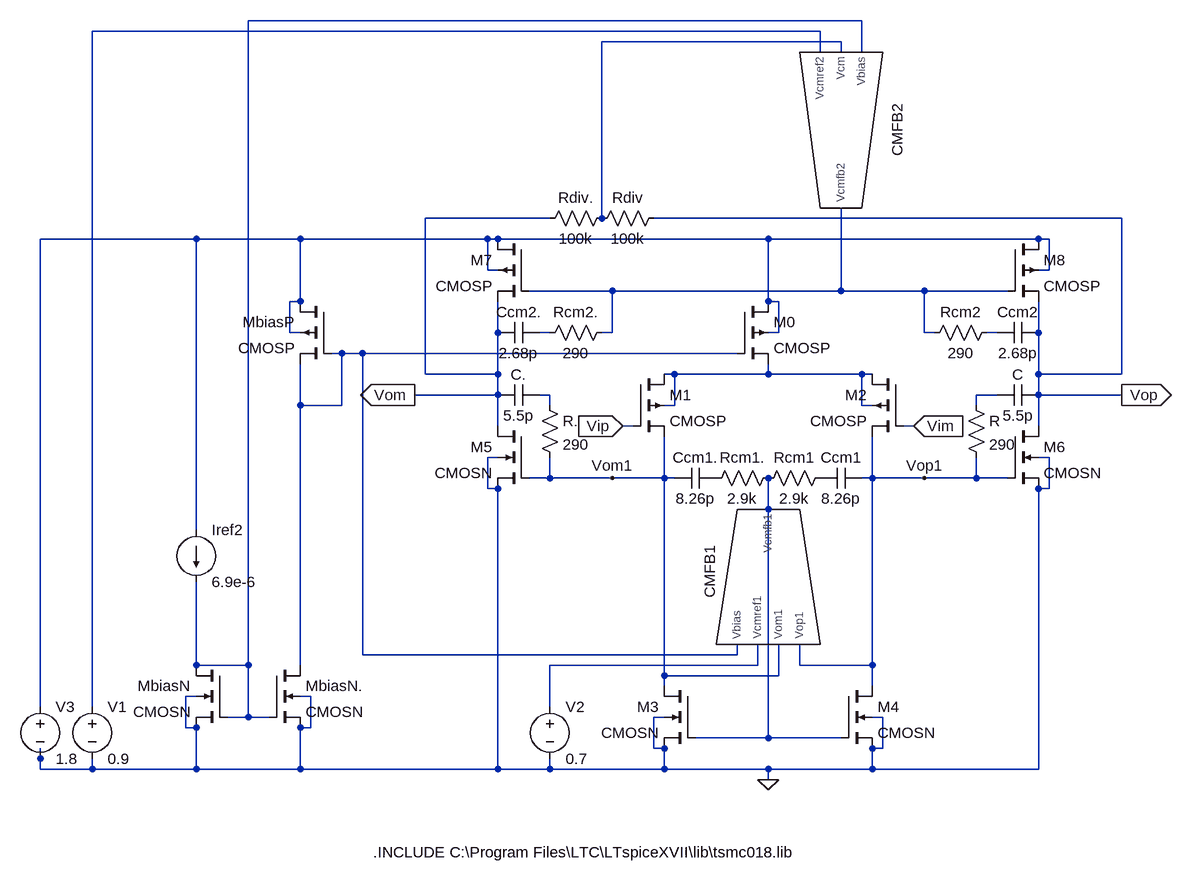
[diagram p0: schematic TwoStageFullyDiffOpamp.asc]
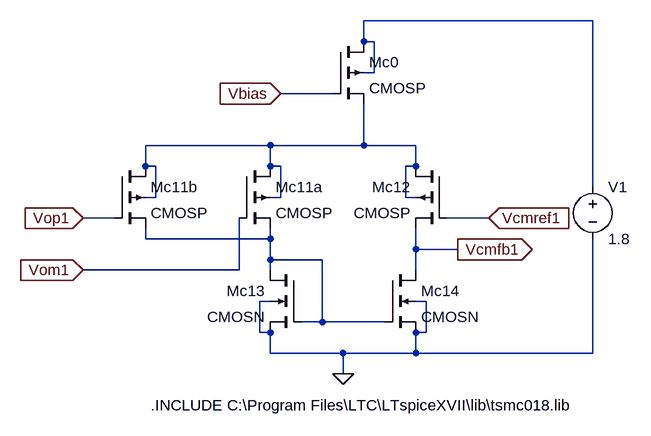
[diagram p1: sub-circuit stage1commonmodefeedback.asc]
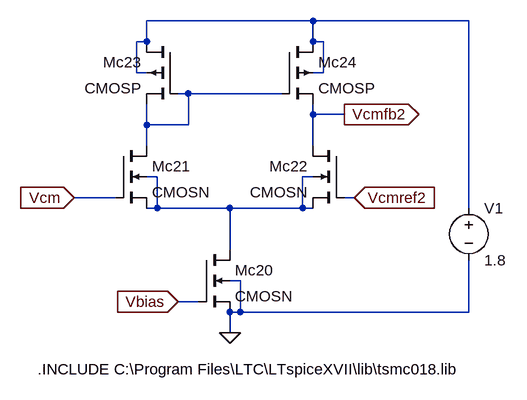
[diagram p2: sub-circuit stage2commonmodefeedback.asc]
TwoStageFullyDiffOpamp.asc, the LTspice schematic file:
Version 4
SHEET 1 1544 680
WIRE 512 -752 -432 -752
WIRE 448 -736 -672 -736
WIRE 480 -720 112 -720
WIRE 448 -704 448 -736
WIRE 480 -704 480 -720
WIRE 512 -704 512 -752
WIRE 32 -448 -160 -448
WIRE 112 -448 112 -720
WIRE 912 -448 192 -448
WIRE -512 -416 -752 -416
WIRE -352 -416 -512 -416
WIRE -64 -416 -352 -416
WIRE -48 -416 -64 -416
WIRE 368 -416 -48 -416
WIRE 784 -416 368 -416
WIRE 800 -416 784 -416
WIRE -64 -368 -64 -416
WIRE -48 -368 -64 -368
WIRE 800 -368 800 -416
WIRE 800 -368 784 -368
WIRE 128 -336 0 -336
WIRE 480 -336 480 -464
WIRE 480 -336 128 -336
WIRE 608 -336 480 -336
WIRE 736 -336 608 -336
WIRE -352 -320 -352 -416
WIRE -352 -320 -368 -320
WIRE 368 -320 368 -416
WIRE 384 -320 368 -320
WIRE -368 -272 -368 -320
WIRE -352 -272 -368 -272
WIRE -48 -272 -48 -320
WIRE 32 -272 16 -272
WIRE 128 -272 128 -336
WIRE 128 -272 112 -272
WIRE 384 -272 384 -320
WIRE 384 -272 368 -272
WIRE 608 -272 608 -336
WIRE 624 -272 608 -272
WIRE 720 -272 704 -272
WIRE 784 -272 784 -320
WIRE -288 -240 -304 -240
WIRE -256 -240 -288 -240
WIRE 320 -240 -256 -240
WIRE -160 -208 -160 -448
WIRE -48 -208 -48 -272
WIRE -48 -208 -160 -208
WIRE 224 -208 208 -208
WIRE 368 -208 368 -224
WIRE 368 -208 224 -208
WIRE 512 -208 368 -208
WIRE 528 -208 512 -208
WIRE 784 -208 784 -272
WIRE 912 -208 912 -448
WIRE 912 -208 784 -208
WIRE -48 -176 -48 -208
WIRE -48 -176 -176 -176
WIRE 32 -176 16 -176
WIRE 720 -176 688 -176
WIRE 784 -176 784 -208
WIRE 912 -176 784 -176
WIRE -352 -160 -352 -224
WIRE -288 -160 -288 -240
WIRE -288 -160 -352 -160
WIRE 32 -160 32 -176
WIRE 224 -160 224 -208
WIRE 224 -160 208 -160
WIRE 512 -160 512 -208
WIRE 528 -160 512 -160
WIRE 688 -160 688 -176
WIRE -48 -128 -48 -176
WIRE 160 -128 144 -128
WIRE 592 -128 576 -128
WIRE 784 -128 784 -176
WIRE -48 -80 -64 -80
WIRE 800 -80 784 -80
WIRE 32 -48 32 -80
WIRE 32 -48 0 -48
WIRE 128 -48 32 -48
WIRE 208 -48 208 -112
WIRE 208 -48 128 -48
WIRE 224 -48 208 -48
WIRE 528 -48 528 -112
WIRE 528 -48 512 -48
WIRE 608 -48 528 -48
WIRE 688 -48 688 -80
WIRE 688 -48 608 -48
WIRE 736 -48 688 -48
WIRE -64 -32 -64 -80
WIRE -48 -32 -64 -32
WIRE 800 -32 800 -80
WIRE 800 -32 784 -32
WIRE 368 0 368 -48
WIRE -512 32 -512 -416
WIRE -256 224 -256 -240
WIRE 320 224 320 208
WIRE 320 224 -256 224
WIRE -512 240 -512 112
WIRE -432 240 -432 -752
WIRE -432 240 -512 240
WIRE -352 240 -352 -160
WIRE 352 240 352 208
WIRE 352 240 32 240
WIRE 416 240 416 208
WIRE 528 240 528 -48
WIRE 528 240 416 240
WIRE 208 256 208 -48
WIRE 384 256 384 208
WIRE 384 256 208 256
WIRE 208 272 208 256
WIRE 528 272 528 240
WIRE -512 288 -528 288
WIRE -336 288 -352 288
WIRE -752 304 -752 -416
WIRE -672 304 -672 -736
WIRE 32 304 32 240
WIRE -432 320 -432 240
WIRE -432 320 -464 320
WIRE -400 320 -432 320
WIRE 208 320 192 320
WIRE 544 320 528 320
WIRE -528 336 -528 288
WIRE -512 336 -528 336
WIRE -336 336 -336 288
WIRE -336 336 -352 336
WIRE 368 352 368 0
WIRE 368 352 256 352
WIRE 480 352 368 352
WIRE 192 368 192 320
WIRE 208 368 192 368
WIRE 544 368 544 320
WIRE 544 368 528 368
WIRE -752 384 -752 368
WIRE -752 400 -752 384
WIRE -672 400 -672 384
WIRE -672 400 -752 400
WIRE -512 400 -512 336
WIRE -512 400 -672 400
WIRE -352 400 -352 336
WIRE -352 400 -512 400
WIRE -48 400 -48 -32
WIRE -48 400 -352 400
WIRE 32 400 32 384
WIRE 32 400 -48 400
WIRE 208 400 208 368
WIRE 208 400 32 400
WIRE 368 400 208 400
WIRE 528 400 528 368
WIRE 528 400 368 400
WIRE 784 400 784 -32
WIRE 784 400 528 400
WIRE 368 416 368 400
FLAG 608 -48 Vop1
FLAG 128 -48 Vom1
FLAG 592 -128 Vim
IOPIN 592 -128 In
FLAG 144 -128 Vip
IOPIN 144 -128 In
FLAG 368 416 0
FLAG 912 -176 Vop
IOPIN 912 -176 Out
FLAG -176 -176 Vom
IOPIN -176 -176 Out
SYMBOL cap 224 -32 R270
WINDOW 0 32 32 VTop 2
WINDOW 3 0 32 VBottom 2
SYMATTR InstName Ccm1.
SYMATTR Value 8.26p
SYMBOL cap 448 -32 R270
WINDOW 0 32 32 VTop 2
WINDOW 3 0 32 VBottom 2
SYMATTR InstName Ccm1
SYMATTR Value 8.26p
SYMBOL Stage1CommonModeFeedback 368 96 R270
SYMATTR InstName CMFB1
SYMBOL cap 16 -192 R90
WINDOW 0 0 32 VBottom 2
WINDOW 3 32 32 VTop 2
SYMATTR InstName C.
SYMATTR Value 5.5p
SYMBOL cap 784 -288 R90
WINDOW 0 0 32 VBottom 2
WINDOW 3 32 32 VTop 2
SYMATTR InstName Ccm2
SYMATTR Value 2.68p
SYMBOL cap 16 -288 R90
WINDOW 0 0 32 VBottom 2
WINDOW 3 32 32 VTop 2
SYMATTR InstName Ccm2.
SYMATTR Value 2.68p
SYMBOL nmos4 0 -128 M0
SYMATTR InstName M5
SYMATTR Value CMOSN
SYMATTR Value2 l=0.18µ w=10.35µ ad=3.726p as=3.726p pd=21.42µ ps=21.42µ
SYMBOL pmos4 160 -208 R0
SYMATTR InstName M1
SYMATTR Value CMOSP
SYMATTR Value2 l=0.18µ w=4.14µ ad=1.4904p as=1.4904p pd=9µ ps=9µ
SYMBOL pmos4 0 -416 M0
SYMATTR InstName M7
SYMATTR Value CMOSP
SYMATTR Value2 l=0.18µ w=41.4µ ad=14.904p as=14.904p pd=83.52µ ps=83.52µ
SYMBOL cap 784 -192 R90
WINDOW 0 0 32 VBottom 2
WINDOW 3 32 32 VTop 2
SYMATTR InstName C
SYMATTR Value 5.5p
SYMBOL voltage 32 288 R0
WINDOW 123 0 0 Left 2
WINDOW 39 0 0 Left 2
SYMATTR InstName V2
SYMATTR Value 0.7
SYMBOL res 16 -176 R0
SYMATTR InstName R.
SYMATTR Value 290
SYMBOL res 672 -176 R0
SYMATTR InstName R
SYMATTR Value 290
SYMBOL res 384 -64 R90
WINDOW 0 0 56 VBottom 2
WINDOW 3 32 56 VTop 2
SYMATTR InstName Rcm1.
SYMATTR Value 2.9k
SYMBOL res 464 -64 R90
WINDOW 0 0 56 VBottom 2
WINDOW 3 32 56 VTop 2
SYMATTR InstName Rcm1
SYMATTR Value 2.9k
SYMBOL res 128 -288 R90
WINDOW 0 0 56 VBottom 2
WINDOW 3 32 56 VTop 2
SYMATTR InstName Rcm2.
SYMATTR Value 290
SYMBOL res 720 -288 R90
WINDOW 0 0 56 VBottom 2
WINDOW 3 32 56 VTop 2
SYMATTR InstName Rcm2
SYMATTR Value 290
SYMBOL res 128 -464 R90
WINDOW 0 0 56 VBottom 2
WINDOW 3 32 56 VTop 2
SYMATTR InstName Rdiv.
SYMATTR Value 100k
SYMBOL res 208 -464 R90
WINDOW 0 0 56 VBottom 2
WINDOW 3 32 56 VTop 2
SYMATTR InstName Rdiv
SYMATTR Value 100k
SYMBOL Stage2CommonModeFeedback 480 -592 R90
SYMATTR InstName CMFB2
SYMBOL voltage -672 288 R0
WINDOW 123 0 0 Left 2
WINDOW 39 0 0 Left 2
SYMATTR InstName V1
SYMATTR Value 0.9
SYMBOL voltage -752 288 R0
WINDOW 123 0 0 Left 2
WINDOW 39 0 0 Left 2
SYMATTR InstName V3
SYMATTR Value 1.8
SYMBOL current -512 32 R0
WINDOW 123 0 0 Left 2
WINDOW 39 0 0 Left 2
SYMATTR InstName Iref2
SYMATTR Value 6.9e-6
SYMBOL nmos4 -464 240 M0
SYMATTR InstName MbiasN
SYMATTR Value CMOSN
SYMATTR Value2 l=0.2086956522µ w=0.24µ ad=0.0864p as=0.0864p pd=1.2µ ps=1.2µ
SYMBOL pmos4 -304 -320 M0
SYMATTR InstName MbiasP
SYMATTR Value CMOSP
SYMATTR Value2 l=0.18µ w=0.828µ ad=0.29808p as=0.29808p pd=2.376µ ps=2.376µ
SYMBOL pmos4 576 -208 M0
SYMATTR InstName M2
SYMATTR Value CMOSP
SYMATTR Value2 l=0.18µ w=4.14µ ad=1.4904p as=1.4904p pd=9µ ps=9µ
SYMBOL nmos4 480 272 R0
SYMATTR InstName M4
SYMATTR Value CMOSN
SYMATTR Value2 l=0.18µ w=1.035µ ad=0.3726p as=0.3726p pd=2.79µ ps=2.79µ
SYMBOL pmos4 320 -320 R0
SYMATTR InstName M0
SYMATTR Value CMOSP
SYMATTR Value2 l=0.18µ w=0.828µ ad=0.29808p as=0.29808p pd=2.376µ ps=2.376µ m=10
SYMBOL nmos4 -400 240 R0
SYMATTR InstName MbiasN.
SYMATTR Value CMOSN
SYMATTR Value2 l=0.2086956522µ w=0.24µ ad=0.0864p as=0.0864p pd=1.2µ ps=1.2µ
SYMBOL nmos4 256 272 M0
SYMATTR InstName M3
SYMATTR Value CMOSN
SYMATTR Value2 l=0.18µ w=1.035µ ad=0.3726p as=0.3726p pd=2.79µ ps=2.79µ
SYMBOL nmos4 736 -128 R0
SYMATTR InstName M6
SYMATTR Value CMOSN
SYMATTR Value2 l=0.18µ w=10.35µ ad=3.726p as=3.726p pd=21.42µ ps=21.42µ
SYMBOL pmos4 736 -416 R0
SYMATTR InstName M8
SYMATTR Value CMOSP
SYMATTR Value2 l=0.18µ w=41.4µ ad=14.904p as=14.904p pd=83.52µ ps=83.52µ
TEXT -240 528 Left 2 !.INCLUDE C:\\Program Files\\LTC\\LTspiceXVII\\lib\\tsmc018.lib

stage1commonmodefeedback.asc, the sub-circuit schematic file:
Version 4
SHEET 1 1048 680
WIRE 752 -48 400 -48
WIRE 400 -16 400 -48
WIRE 416 -16 400 -16
WIRE 416 32 416 -16
WIRE 416 32 400 32
WIRE 352 64 272 64
WIRE 256 144 64 144
WIRE 400 144 400 80
WIRE 400 144 256 144
WIRE 480 144 400 144
WIRE 64 176 64 144
WIRE 80 176 64 176
WIRE 256 176 256 144
WIRE 272 176 256 176
WIRE 480 176 480 144
WIRE 480 176 464 176
WIRE 752 208 752 -48
WIRE 80 224 80 176
WIRE 80 224 64 224
WIRE 272 224 272 176
WIRE 272 224 256 224
WIRE 464 224 464 176
WIRE 480 224 464 224
WIRE 16 256 -32 256
WIRE 592 256 528 256
WIRE 64 288 64 272
WIRE 256 288 256 272
WIRE 256 288 64 288
WIRE 480 304 480 272
WIRE 544 304 480 304
WIRE 256 320 256 288
WIRE 336 320 256 320
WIRE 208 336 208 256
WIRE 208 336 -32 336
WIRE 256 336 256 320
WIRE 480 336 480 304
WIRE 256 384 240 384
WIRE 496 384 480 384
WIRE 336 416 336 320
WIRE 336 416 304 416
WIRE 432 416 336 416
WIRE 240 432 240 384
WIRE 256 432 240 432
WIRE 496 432 496 384
WIRE 496 432 480 432
WIRE 256 464 256 432
WIRE 368 464 256 464
WIRE 480 464 480 432
WIRE 480 464 368 464
WIRE 752 464 752 288
WIRE 752 464 480 464
WIRE 368 496 368 464
FLAG 368 496 0
FLAG -32 256 Vop1
IOPIN -32 256 In
FLAG -32 336 Vom1
IOPIN -32 336 In
FLAG 592 256 Vcmref1
IOPIN 592 256 In
FLAG 272 64 Vbias
IOPIN 272 64 In
FLAG 544 304 Vcmfb1
IOPIN 544 304 Out
SYMBOL voltage 752 192 R0
WINDOW 123 0 0 Left 2
WINDOW 39 0 0 Left 2
SYMATTR InstName V1
SYMATTR Value 1.8
SYMBOL pmos4 528 176 M0
SYMATTR InstName Mc12
SYMATTR Value CMOSP
SYMATTR Value2 l=0.18µ w=0.414µ ad=0.14904p as=0.14904p pd=1.548µ ps=1.548µ
SYMBOL nmos4 432 336 R0
SYMATTR InstName Mc14
SYMATTR Value CMOSN
SYMATTR Value2 l=0.4173913043µ w=0.24µ ad=0.0864p as=0.0864p pd=1.2µ ps=1.2µ
SYMBOL pmos4 208 176 R0
SYMATTR InstName Mc11a
SYMATTR Value CMOSP
SYMATTR Value2 l=0.2086956522µ w=0.24µ ad=0.0864p as=0.0864p pd=1.2µ ps=1.2µ
SYMBOL pmos4 352 -16 R0
SYMATTR InstName Mc0
SYMATTR Value CMOSP
SYMATTR Value2 l=0.18µ w=0.828µ ad=0.29808p as=0.29808p pd=2.376µ ps=2.376µ
SYMBOL pmos4 16 176 R0
SYMATTR InstName Mc11b
SYMATTR Value CMOSP
SYMATTR Value2 l=0.2086956522µ w=0.24µ ad=0.0864p as=0.0864p pd=1.2µ ps=1.2µ
SYMBOL nmos4 304 336 M0
SYMATTR InstName Mc13
SYMATTR Value CMOSN
SYMATTR Value2 l=0.4173913043µ w=0.24µ ad=0.0864p as=0.0864p pd=1.2µ ps=1.2µ
TEXT 72 544 Left 2 !.INCLUDE C:\\Program Files\\LTC\\LTspiceXVII\\lib\\tsmc018.lib

stage2commonmodefeedback.asc, the sub-circuit schematic file:
Version 4
SHEET 1 1116 680
WIRE 816 -144 560 -144
WIRE 1056 -144 816 -144
WIRE 560 -112 560 -144
WIRE 560 -112 544 -112
WIRE 816 -112 816 -144
WIRE 832 -112 816 -112
WIRE 544 -64 544 -112
WIRE 560 -64 544 -64
WIRE 832 -64 832 -112
WIRE 832 -64 816 -64
WIRE 624 -32 608 -32
WIRE 768 -32 624 -32
WIRE 816 0 816 -16
WIRE 864 0 816 0
WIRE 560 16 560 -16
WIRE 624 16 624 -32
WIRE 624 16 560 16
WIRE 560 48 560 16
WIRE 816 48 816 0
WIRE 576 96 560 96
WIRE 816 96 800 96
WIRE 512 128 448 128
WIRE 880 128 864 128
WIRE 576 144 576 96
WIRE 576 144 560 144
WIRE 688 144 576 144
WIRE 800 144 800 96
WIRE 800 144 688 144
WIRE 816 144 800 144
WIRE 1056 144 1056 -144
WIRE 688 208 688 144
WIRE 704 256 688 256
WIRE 640 288 608 288
WIRE 704 304 704 256
WIRE 704 304 688 304
WIRE 1056 304 1056 224
WIRE 1056 304 704 304
WIRE 688 336 688 304
FLAG 608 288 Vbias
IOPIN 608 288 In
FLAG 448 128 Vcm
IOPIN 448 128 In
FLAG 880 128 Vcmref2
IOPIN 880 128 In
FLAG 864 0 Vcmfb2
IOPIN 864 0 Out
FLAG 688 336 0
SYMBOL voltage 1056 128 R0
WINDOW 123 0 0 Left 2
WINDOW 39 0 0 Left 2
SYMATTR InstName V1
SYMATTR Value 1.8
SYMBOL pmos4 608 -112 M0
SYMATTR InstName Mc23
SYMATTR Value CMOSP
SYMATTR Value2 l=0.18µ w=4.14µ ad=1.4904p as=1.4904p pd=9µ ps=9µ
SYMBOL nmos4 512 48 R0
SYMATTR InstName Mc21
SYMATTR Value CMOSN
SYMATTR Value2 l=0.18µ w=1.035µ ad=0.3726p as=0.3726p pd=2.79µ ps=2.79µ
SYMBOL nmos4 640 208 R0
SYMATTR InstName Mc20
SYMATTR Value CMOSN
SYMATTR Value2 l=0.18µ w=2.07µ ad=0.7452p as=0.7452p pd=4.86µ ps=4.86µ
SYMBOL nmos4 864 48 M0
SYMATTR InstName Mc22
SYMATTR Value CMOSN
SYMATTR Value2 l=0.18µ w=1.035µ ad=0.3726p as=0.3726p pd=2.79µ ps=2.79µ
SYMBOL pmos4 768 -112 R0
SYMATTR InstName Mc24
SYMATTR Value CMOSP
SYMATTR Value2 l=0.18µ w=4.14µ ad=1.4904p as=1.4904p pd=9µ ps=9µ
TEXT 392 392 Left 2 !.INCLUDE C:\\Program Files\\LTC\\LTspiceXVII\\lib\\tsmc018.lib

The netlist it stands for:
* TwoStageFullyDiffOpamp.asc
Ccm1. Vom1 P001 8.26p
Ccm1 P002 Vop1 8.26p
XCMFB1 N008 N013 Vom1 Vop1 N012 stage1commonmodefeedback
C. N010 Vom 5.5p
Ccm2 Vop N007 2.68p
Ccm2. N006 Vom 2.68p
M5 Vom Vom1 0 0 CMOSN l=0.18µ w=10.35µ ad=3.726p as=3.726p pd=21.42µ ps=21.42µ
M1 N009 Vip Vom1 N009 CMOSP l=0.18µ w=4.14µ ad=1.4904p as=1.4904p pd=9µ ps=9µ
M7 N004 N005 Vom N004 CMOSP l=0.18µ w=41.4µ ad=14.904p as=14.904p pd=83.52µ ps=83.52µ
C Vop N011 5.5p
V2 N013 0 0.7
R. N010 Vom1 290
R N011 Vop1 290
Rcm1. N012 P001 2.9k
Rcm1 P002 N012 2.9k
Rcm2. N005 N006 290
Rcm2 N007 N005 290
Rdiv. N003 Vom 100k
Rdiv Vop N003 100k
XCMFB2 N001 N003 N002 N005 stage2commonmodefeedback
V1 N002 0 0.9
V3 N004 0 1.8
Iref2 N004 N001 6.9e-6
MbiasN N001 N001 0 0 CMOSN l=0.2086956522µ w=0.24µ ad=0.0864p as=0.0864p pd=1.2µ ps=1.2µ
MbiasP N004 N008 N008 N004 CMOSP l=0.18µ w=0.828µ ad=0.29808p as=0.29808p pd=2.376µ ps=2.376µ
M2 N009 Vim Vop1 N009 CMOSP l=0.18µ w=4.14µ ad=1.4904p as=1.4904p pd=9µ ps=9µ
M4 Vop1 N012 0 0 CMOSN l=0.18µ w=1.035µ ad=0.3726p as=0.3726p pd=2.79µ ps=2.79µ
M0 N004 N008 N009 N004 CMOSP l=0.18µ w=0.828µ ad=0.29808p as=0.29808p pd=2.376µ ps=2.376µ m=10
MbiasN. N008 N001 0 0 CMOSN l=0.2086956522µ w=0.24µ ad=0.0864p as=0.0864p pd=1.2µ ps=1.2µ
M3 Vom1 N012 0 0 CMOSN l=0.18µ w=1.035µ ad=0.3726p as=0.3726p pd=2.79µ ps=2.79µ
M6 Vop Vop1 0 0 CMOSN l=0.18µ w=10.35µ ad=3.726p as=3.726p pd=21.42µ ps=21.42µ
M8 N004 N005 Vop N004 CMOSP l=0.18µ w=41.4µ ad=14.904p as=14.904p pd=83.52µ ps=83.52µ

* block symbol definitions
.subckt stage1commonmodefeedback Vbias Vcmref1 Vom1 Vop1 Vcmfb1
V1 N001 0 1.8
Mc12 N002 Vcmref1 Vcmfb1 N002 CMOSP l=0.18µ w=0.414µ ad=0.14904p as=0.14904p pd=1.548µ ps=1.548µ
Mc14 Vcmfb1 N003 0 0 CMOSN l=0.4173913043µ w=0.24µ ad=0.0864p as=0.0864p pd=1.2µ ps=1.2µ
Mc11a N002 Vom1 N003 N002 CMOSP l=0.2086956522µ w=0.24µ ad=0.0864p as=0.0864p pd=1.2µ ps=1.2µ
Mc0 N001 Vbias N002 N001 CMOSP l=0.18µ w=0.828µ ad=0.29808p as=0.29808p pd=2.376µ ps=2.376µ
Mc11b N002 Vop1 N003 N002 CMOSP l=0.2086956522µ w=0.24µ ad=0.0864p as=0.0864p pd=1.2µ ps=1.2µ
Mc13 N003 N003 0 0 CMOSN l=0.4173913043µ w=0.24µ ad=0.0864p as=0.0864p pd=1.2µ ps=1.2µ
.INCLUDE C:\Program Files\LTC\LTspiceXVII\lib\tsmc018.lib
.ends stage1commonmodefeedback

.subckt stage2commonmodefeedback Vbias Vcm Vcmref2 Vcmfb2
V1 N001 0 1.8
Mc23 N001 N002 N002 N001 CMOSP l=0.18µ w=4.14µ ad=1.4904p as=1.4904p pd=9µ ps=9µ
Mc21 N002 Vcm N003 N003 CMOSN l=0.18µ w=1.035µ ad=0.3726p as=0.3726p pd=2.79µ ps=2.79µ
Mc20 N003 Vbias 0 0 CMOSN l=0.18µ w=2.07µ ad=0.7452p as=0.7452p pd=4.86µ ps=4.86µ
Mc22 Vcmfb2 Vcmref2 N003 N003 CMOSN l=0.18µ w=1.035µ ad=0.3726p as=0.3726p pd=2.79µ ps=2.79µ
Mc24 N001 N002 Vcmfb2 N001 CMOSP l=0.18µ w=4.14µ ad=1.4904p as=1.4904p pd=9µ ps=9µ
.INCLUDE C:\Program Files\LTC\LTspiceXVII\lib\tsmc018.lib
.ends stage2commonmodefeedback

.model NMOS NMOS
.model PMOS PMOS
.lib standard.mos
.INCLUDE C:\Program Files\LTC\LTspiceXVII\lib\tsmc018.lib
.backanno
.end